# Altium schematic sheet Pg11_ USB1.SchDoc: USB OTG & HOST
size A2; DocumentNumber: 11; SheetNumber: 11; SheetTotal: 16
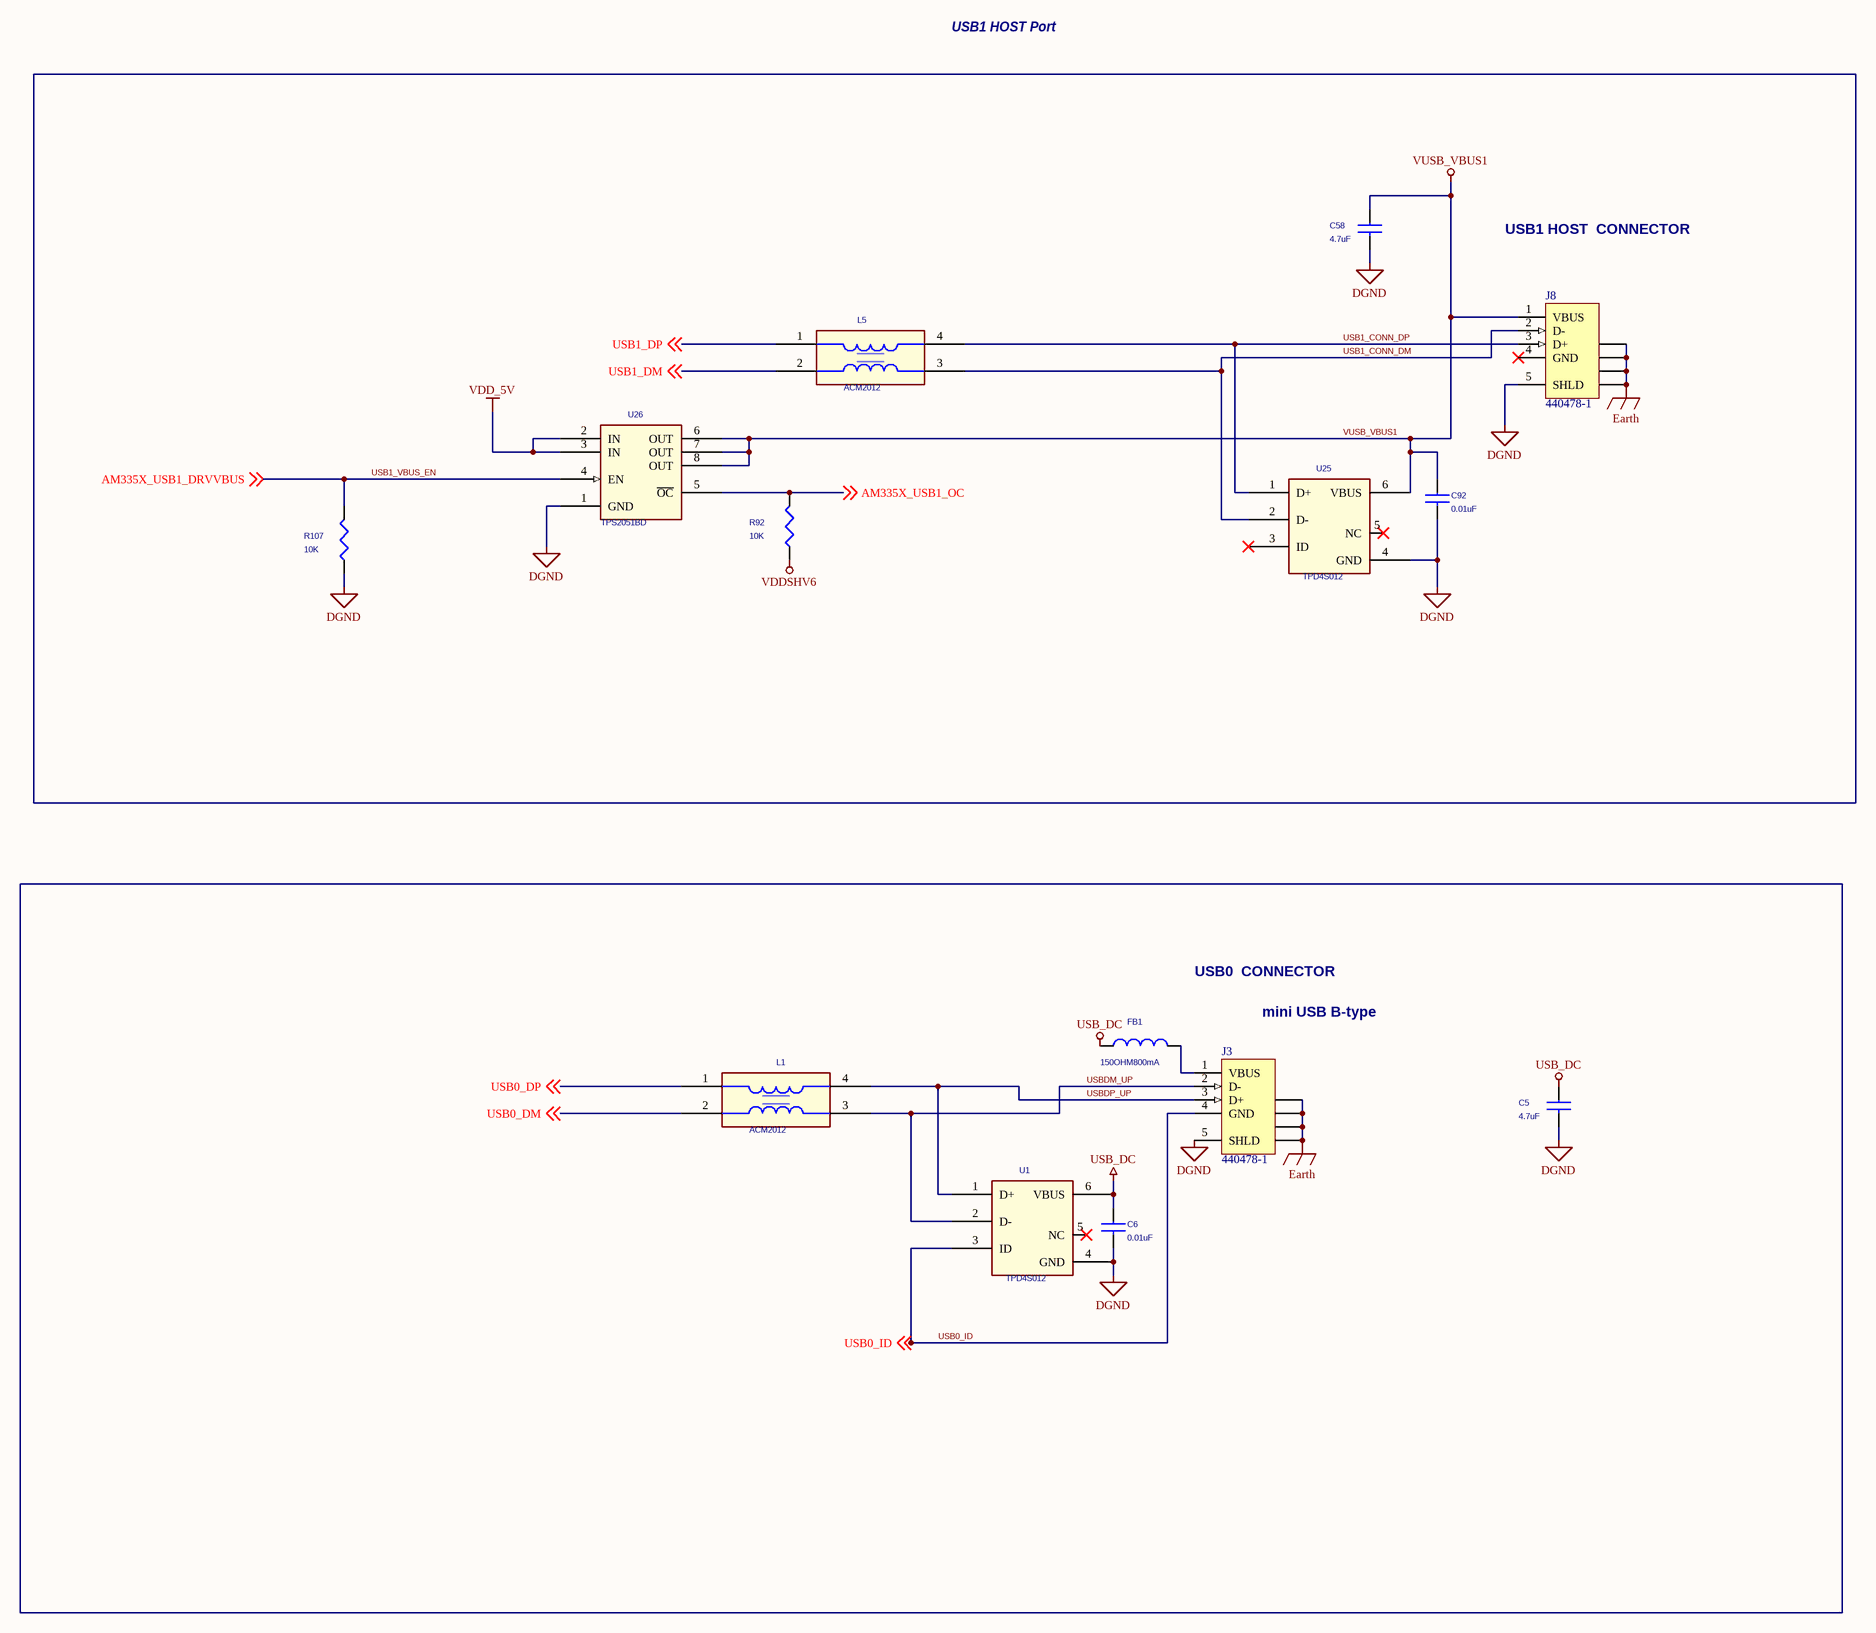
[diagram p0: Pg11_ USB1.SchDoc]

## Parts
?  (no value)  (graphical)
C5  4.7uF  [SM-7351-CAP-0603]
C6  0.01uF  [SM-7351-CAP-0402]
C58  4.7uF  [SM-7351-CAP-0603]
C92  0.01uF  [SM-7351-CAP-0402]
FB1  150OHM800mA  [sm-7351-ind-0805]
J3  440478-1  [440478]
J8  440478-1  [440478]
L1  ACM2012  [ACM2012H]
L5  ACM2012  [ACM2012H]
R92  10K  [SM-7351-RES-0402]
R107  10K  [SM-7351-RES-0402]
U1  TPD4S012  [U_6_DRY]
U25  TPD4S012  [U_6_DRY]
U26  TPS2051BD  [U_8_D]

## Blocks framed on the sheet
USB1 HOST  CONNECTOR: C58 C92 J8 L5 R92 R107 U25 U26

## Nets
DGND: C5.2 C6.2 C58.2 C92.2 J3.5(SHLD) J8.5(SHLD) R107.2(P2) U1.4(GND) U25.4(GND) U26.1(GND)
Earth: J3.6(SHLD) J3.7(SHLD) J3.8(SHLD) J3.9(SHLD) J8.6(SHLD) J8.7(SHLD) J8.8(SHLD) J8.9(SHLD)
USB_DC: C5.1 C6.1 FB1.1 U1.6(VBUS)
VDD_5V: U26.2(IN) U26.3(IN)
VDDSHV6: R92.2(P2)
VUSB_VBUS1: C58.1 C92.1 J8.1(VBUS) U25.6(VBUS) U26.6(OUT) U26.7(OUT) U26.8(OUT)
AM335X_USB1_OC: R92.1(P1) U26.5(~{OC}) ; off-sheet AM335X_USB1_OC
USB0_DM: L1.2 ; off-sheet USB0_DM
USB0_DP: L1.1 ; off-sheet USB0_DP
USB0_ID: J3.4(GND) U1.3(ID) ; off-sheet USB0_ID
USB1_CONN_DM: J8.2(D-) L5.3 U25.2(D-)
USB1_CONN_DP: J8.3(D+) L5.4 U25.1(D+)
USB1_DM: L5.2 ; off-sheet USB1_DM
USB1_DP: L5.1 ; off-sheet USB1_DP
USB1_VBUS_EN: R107.1(P1) U26.4(EN) ; off-sheet AM335X_USB1_DRVVBUS  [also labelled AM335X_USB1_DRVVBUS]
USBDM_UP: J3.2(D-) L1.3 U1.2(D-)
USBDP_UP: J3.3(D+) L1.4 U1.1(D+)
NetFB1_2: FB1.2 J3.1(VBUS)

Not connected (* = marked no-connect by the designer): J8 4(GND)*; U1 5(NC)*; U25 3(ID)* 5(NC)*

## Notes on the sheet
- USB1 HOST Port
- USB0  CONNECTOR
- (near J3) mini USB B-type
- Embedded Vision Systems Group
- Title
- School of Electrical and Electronic Engineering
- Date:
- Size
- Document Number
- Sheet
- of
- Rev

## Library data of the parts
? = Title Block Address(1): UoM title block
C5 C58 = 4.7uFCapacitor16V10%0603: TIIntPartnumber: 1C0103; MfrNum: EMK107ABJ475KA-T; Mfr: Taiyo Yuden; PartName: 4.7uF16V10%SMD0603; Cost10K: 0.00590; Cost100: 0.0198; Vendor: Digikey; DescriptiveText: Capacitor Ceramic 4.7uF 16V 10% 0603
C6 C92 = 0.01uFCapacitor16V10%0402_Dup1: Mfr: Panasonic; PartName: 0.01uF16V10%SMD0402; MfrNum: ECJ-0YB1C103K; TIIntPartnumber: 1C0012; PN: 0402YC103KAT2A; TN: 207-0054-000; Vendor: Digikey; Cost100: 0.00; Cost10K: 0.015; DescriptiveText: Capacitor 0.01uF 16V 10% 0402
FB1 = FerBead_3: Ferrite Bead 150 Ohm 800mA; Mfr: Steward; MfrNum: LI0805H151R-10; TIIntPartnumber: 1L0010; Vendor: Digikey; Cost100: 0.068; Cost10K: 0.045; DescriptiveText: Ferrite Bead 150 Ohm 800mA; PartName: FerriteBead150ohm800mA; Descriptive_Text: Ferrite Bead 150 Ohm 800mA
J3 J8 = 440478-1: USB 2.0, Right Angle, SMT, A Type, Receptacle, 5 Position, Black; ContactMaterial: Phosphor Bronze; ContactPlating: Gold (30) over Nickel; PCB_Layout: Complies with manufacturer's recommendation.; DrillSize: Corresponds to nominal value.; PanelGround: Without; Published: 15-Jul-2004; DatasheetDocument: 15-Nov-2002; PackageDocument: 15-Nov-2002; PackageReference: 440478; Publisher: Altium Limited; HousingMaterial: Thermoplastic; ComponentLink1Description: Manufacturer Link; ComponentLink1URL: http://www.tycoelectronics.com/; ComponentLink2Description: Packaging Specification; ComponentLink2URL: http://ecommas.tycoelectronics.com/commerce/DocumentDelivery/DDEController?Action=showdoc&DocId=Customer+Drawing%7F440478%7FB%7Fpdf%7FEnglish%7FC_440478_B.pdf
L1 L5 = ACM2012: Common Mode Filter for USB/HDMI; TIIntPartnumber: 1M0003; MfrNum: ACM2012H-900-2P; Mfr: TDK; Cost10K: 0.33; Cost100: 1.11; Vendor: Arrow; Descriptive_Text: Common Mode Filter for USB/HDMI; PartName: ACM2012; DescriptiveText: Common Mode Filter for USB/HDMI
R92 = 10KOhmResistor1/16W0402_Dup1: Resistor 10Kohm 1/16W 5% 0402; TIIntPartnumber: 1R0168; MfrNum: MCR01MZPJ103; Mfr: Rohm; PartName: 10Kohm1/16W5%SMD0402; Cost10K: 0.0017; Cost100: 0.03; Vendor: DIGIKEY; Descriptive_Text: Resistor 10Kohm 1/16W 5% 0402; DescriptiveText: Resistor 10Kohm 1/16W 5% 0402
R107 = 10KOhmResistor1/16W0402_Dup1: Resistor 10Kohm 1/16W 5% 0402; TIIntPartnumber: 1R0168; MfrNum: MCR01MZPJ103; Mfr: Rohm; PartName: 10Kohm1/16W5%SMD0402; Cost10K: 0.0017; Cost100: 0.03; Vendor: Digikey; Descriptive_Text: Resistor 10Kohm 1/16W 5% 0402; DescriptiveText: Resistor 10Kohm 1/16W 5% 0402
U1 U25 = TPD4S012: ESD 4channel USB Interface; Mfr: TI; MfrNum: TPD4S012DRY; TIIntPartnumber: 1A0233; Vendor: Digikey; Cost100: 0.76; Cost10K: 0.12; DescriptiveText: ESD 4channel USB Interface; PartName: TPD4S012; Descriptive_Text: ESD 4channel USB Interface
U26 = TPS2051BD: Power Distribution Switch Current Limited 500mA; Mfr: TI; TIIntPartnumber: 1A0286; Vendor: Digikey; Cost100: 1.70; Cost10K: 0.17; DescriptiveText: Power Distribution Switch Current Limited 500mA; PartName: TPS2051BD; MfrNum: TPS2051BD; Descriptive_Text: Power Distribution Switch Current Limited 500mA